# Altium schematic sheet Host_Controller.SchDoc: Host Controller
size A4
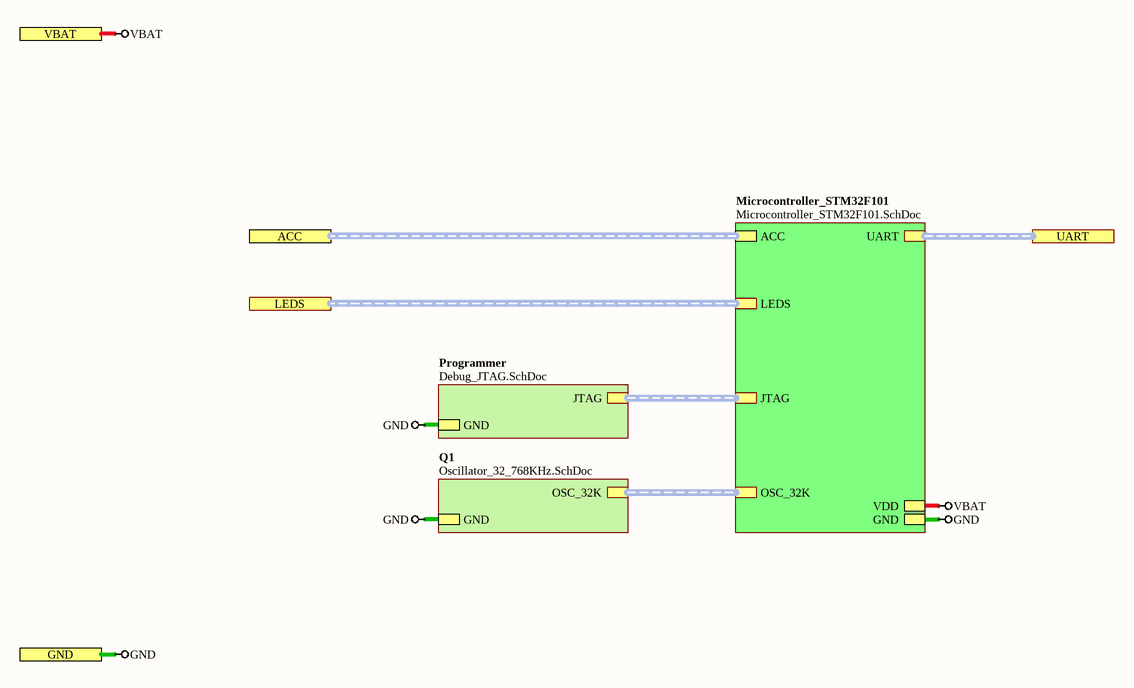
[diagram p0: Host_Controller.SchDoc]

## Sub-sheets
Microcontroller_STM32F101 = Microcontroller_STM32F101.SchDoc: JTAG (harness JTAG), GND, VDD, UART (harness UART_HS), OSC_32K (harness OSC), LEDS (harness LEDx6), ACC (harness SPI_LIS331)
Programmer = Debug_JTAG.SchDoc: JTAG (harness JTAG), GND
Q1 = Oscillator_32_768KHz.SchDoc: GND, OSC_32K (harness OSC)

## Ports
ACC (harness SPI_LIS331), GND, LEDS (harness LEDx6), UART (harness UART_HS), VBAT

## Nets
GND: port GND, sheet Programmer/GND, sheet Microcontroller_STM32F101/GND, sheet Q1/GND
VBAT: port VBAT, sheet Microcontroller_STM32F101/VDD

## Buses and harness runs
harness port ACC = sheet Microcontroller_STM32F101/ACC
harness port LEDS = sheet Microcontroller_STM32F101/LEDS
harness port UART = sheet Microcontroller_STM32F101/UART
harness sheet Microcontroller_STM32F101/JTAG = sheet Programmer/JTAG
harness sheet Microcontroller_STM32F101/OSC_32K = sheet Q1/OSC_32K

## Notes on the sheet
- Sheet Title
- Project Title
- Size:
- Date:
- A4
- Item:
- Time:
- Revision:
- Sheet
- of
- File: